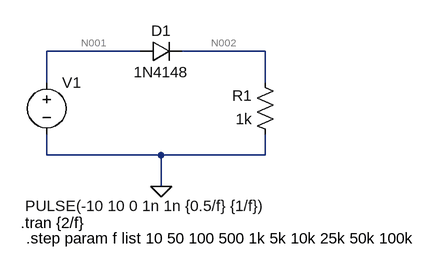
[diagram p0: schematic Diodo4148_2.asc]
Diodo4148_2.asc, the LTspice schematic file:
Version 4.1
SHEET 1 880 680
WIRE 208 64 64 64
WIRE 400 64 272 64
WIRE 64 112 64 64
WIRE 400 112 400 64
WIRE 64 224 64 192
WIRE 240 224 64 224
WIRE 400 224 400 192
WIRE 400 224 240 224
WIRE 240 272 240 224
FLAG 240 272 0
SYMBOL voltage 64 96 R0
WINDOW 3 -33 206 Left 2
WINDOW 123 0 0 Left 0
WINDOW 39 0 0 Left 0
SYMATTR Value PULSE(-10 10 0 1n 1n {0.5/f} {1/f})
SYMATTR InstName V1
SYMBOL res 416 208 R180
WINDOW 0 36 76 Left 2
WINDOW 3 36 40 Left 2
SYMATTR InstName R1
SYMATTR Value 1k
SYMBOL diode 208 80 R270
WINDOW 0 32 32 VTop 2
WINDOW 3 0 32 VBottom 2
SYMATTR InstName D1
SYMATTR Value 1N4148
TEXT 24 328 Left 2 !.tran {2/f}
TEXT 32 352 Left 2 !.step param f list 10 50 100 500 1k 5k 10k 25k 50k 100k

The netlist it stands for:
* Diodo4148_2.asc
V1 N001 0 PULSE(-10 10 0 1n 1n {0.5/f} {1/f})
R1 0 N002 1k
D1 N001 N002 1N4148
.model D D
.lib standard.dio
.tran {2/f}
.step param f list 10 50 100 500 1k 5k 10k 25k 50k 100k
.backanno
.end

* Results of the author's LTspice run, read from the files saved beside the schematic
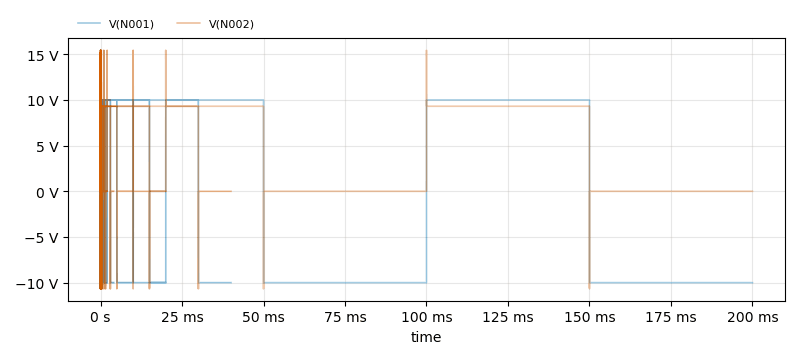
[diagram p1: Transient Analysis of Diodo4148_2.asc, plotted from the saved traces]
* Transient Analysis, 10 runs:
*   V(N001) [run 1]: min -10 V, max 10 V, average 0 V, rms 10 V, last -10 V
*   V(N001) [run 2]: min -10 V, max 10 V, average 0 V, rms 10 V, last -10 V
*   V(N001) [run 3]: min -10 V, max 10 V, average 2 µV, rms 10 V, last -10 V
*   V(N001) [run 4]: min -10 V, max 10 V, average 10 µV, rms 10 V, last -10 V
*   V(N001) [run 5]: min -10 V, max 10 V, average 20 µV, rms 10 V, last -10 V
*   V(N001) [run 6]: min -10 V, max 10 V, average 100 µV, rms 10 V, last -10 V
*   V(N001) [run 7]: min -10 V, max 10 V, average 200 µV, rms 10 V, last -10 V
*   V(N001) [run 8]: min -10 V, max 10 V, average 500 µV, rms 10 V, last -10 V
*   V(N002) [run 1]: min -10.68 V, max 15.43 V, average 4.655 V, rms 6.583 V, last 12.23 µV
*   V(N002) [run 2]: min -10.68 V, max 15.43 V, average 4.655 V, rms 6.583 V, last 11.77 µV
*   V(N002) [run 3]: min -10.68 V, max 15.43 V, average 4.655 V, rms 6.583 V, last -16.27 µV
*   V(N002) [run 4]: min -10.68 V, max 15.43 V, average 4.655 V, rms 6.583 V, last -12.48 µV
*   V(N002) [run 5]: min -10.68 V, max 15.43 V, average 4.655 V, rms 6.583 V, last 4.128 µV
*   V(N002) [run 6]: min -10.68 V, max 15.43 V, average 4.654 V, rms 6.583 V, last -2.809 µV
*   V(N002) [run 7]: min -10.68 V, max 15.43 V, average 4.653 V, rms 6.584 V, last -2.523 µV
*   V(N002) [run 8]: min -10.68 V, max 15.43 V, average 4.652 V, rms 6.586 V, last -2.53 µV